# EAGLE design Medium_switch (EAGLE 9.6.2)
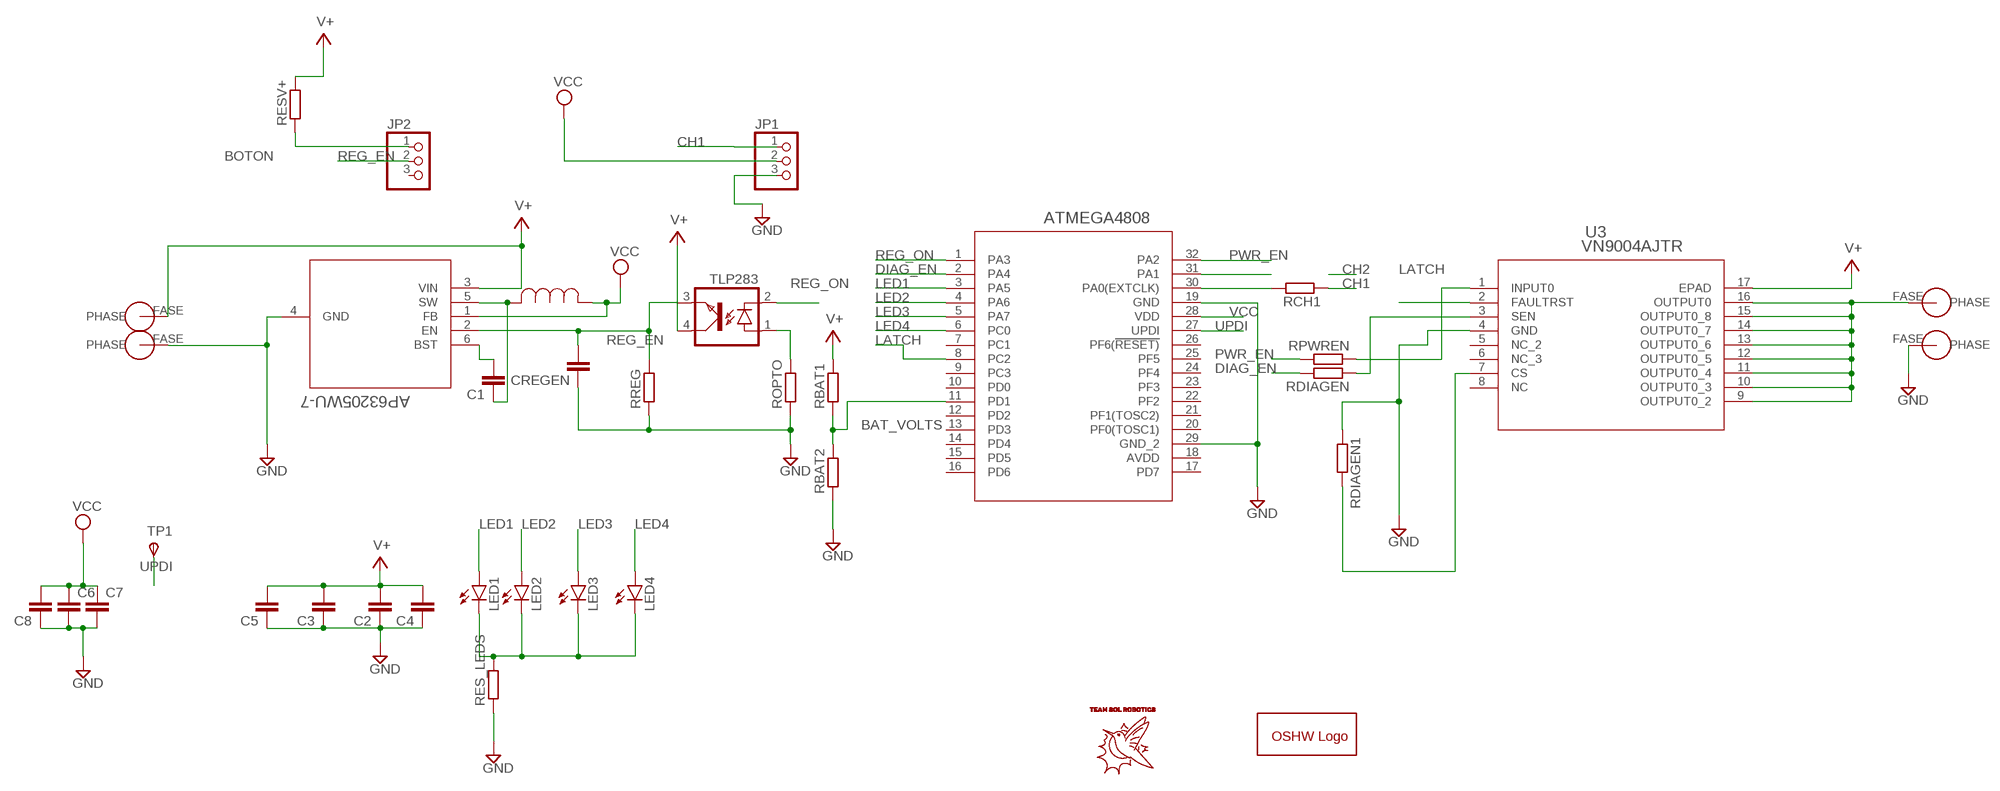
[diagram p0: schematic, sheet 1]

## Parts
BAT+  PHASE  [POWEROUT]
C1  C-EUC0402  [C0402]
C2  C-EUC1206  [C1206]
C3  C-EUC0402  [C0402]
C4  C-EUC1206  [C1206]
C5  C-EUC0603  [C0603]
C6  C-EUC0805  [C0805]
C7  C-EUC0805  [C0805]
C8  C-EUC0402  [C0402]
CREGEN  C-EUC0402  [C0402]
FASEA1  PHASE  [POWEROUT]
FASEA3  PHASE  [POWEROUT]
GOLD_ORB_SM1  OSHWLOGOLOGO5MM  [OSHW_5MM]
JP1  PINHD-1X03_2.54-S  [1X03-S]
JP2  PINHD-1X03_2.54-S  [1X03-S]
LED1  LEDSML0603  [SML0603]
LED2  LEDSML0603  [SML0603]
LED3  LEDSML0603  [SML0603]
LED4  LEDSML0603  [SML0603]
OK1  TLP283  [MINI-FLAT-4]
OUTPUTPWR  PHASE  [POWEROUT]
RBAT1  R-EU_R0603  [R0603]
RBAT2  R-EU_R0603  [R0603]
RCH1  R-EU_R0603  [R0603]
RDIAGEN  R-EU_R0603  [R0603]
RDIAGEN1  R-EU_R0603  [R0603]
RES_LEDS  R-EU_R0603  [R0603]
RESV+  R-EU_R0603  [R0603]
ROPTO  R-EU_R0603  [R0603]
RPWREN  R-EU_R0603  [R0603]
RREG  R-EU_R0603  [R0603]
TP1  TPSTP10SQ  [TP10SQ]
U2  AP63205WU-7  [SOIC_05WU-7_DIO]
U3  VN9004AJTR  [POWERSSO16_VN9004_STM]
U$1  ATMEGA4808  [QFP80P900X900X120-32N]
U$3  INDUCTOR4.7  [IND_NRS5030T100MMGJ_TAY]

## Nets
BAT_VOLTS: RBAT1.1 RBAT2.2 U$1.11(PD1)
BOTON: JP2.1 RESV+.1
CH1: JP1.1 RCH1.1
DIAG_EN: RDIAGEN.2 U$1.2(PA4)
GND: C2.1 C3.1 C4.1 C5.1 C6.2 C7.2 C8.1 CREGEN.1 FASEA1.FASE(PHASE) FASEA3.FASE(PHASE) JP1.3 RBAT2.1 RDIAGEN1.1 RES_LEDS.1 ROPTO.1 RREG.1 U2.4(GND) U3.4(GND) U$1.19(GND) U$1.29(GND_2)
LATCH: U3.2(FAULTRST) U$1.8(PC2)
LED1: LED1.A U$1.3(PA5)
LED2: LED2.A U$1.4(PA6)
LED3: LED3.A U$1.5(PA7)
LED4: LED4.A U$1.6(PC0)
N$1: OK1.1(A) ROPTO.2
N$2: LED1.C LED2.C LED3.C LED4.C RES_LEDS.2
N$3: RCH1.2 U$1.30(PA0(EXTCLK))
N$4: U$1.31(PA1)
N$5: RDIAGEN1.2 U3.7(CS)
N$6: C1.1 U2.5(SW) U$3.2
N$7: RPWREN.1 U3.1(INPUT0)
N$8: C1.2 U2.6(BST)
N$9: RDIAGEN.1 U3.3(SEN)
N$10: OUTPUTPWR.FASE(PHASE) U3.9(OUTPUT0_2) U3.10(OUTPUT0_3) U3.11(OUTPUT0_4) U3.12(OUTPUT0_5) U3.13(OUTPUT0_6) U3.14(OUTPUT0_7) U3.15(OUTPUT0_8) U3.16(OUTPUT0)
PWR_EN: RPWREN.2 U$1.32(PA2)
REG_EN: CREGEN.2 JP2.2 OK1.3(EMIT) RREG.2 U2.2(EN)
REG_ON: OK1.2(C) U$1.1(PA3)
UPDI: TP1.TP(PP) U$1.27(UPDI)
V+: BAT+.FASE(PHASE) C2.2 C3.2 C4.2 C5.2 OK1.4(COL) RBAT1.2 RESV+.2 U2.3(VIN) U3.17(EPAD)
VCC: C6.1 C7.1 C8.2 JP1.2 U2.1(FB) U$1.28(VDD) U$3.1
Unconnected: JP2.3 U3.5(NC_2) U3.6(NC_3) U3.8(NC) U$1.7(PC1) U$1.9(PC3) U$1.10(PD0) U$1.12(PD2) U$1.13(PD3) U$1.14(PD4) U$1.15(PD5) U$1.16(PD6) U$1.17(PD7) U$1.20(PF0(TOSC1)) U$1.21(PF1(TOSC2)) U$1.22(PF2) U$1.23(PF3) U$1.24(PF4) U$1.25(PF5) U$1.26(PF6(!RESET))

## Power pins joined to a net without a drawn wire
AVDD: U$1.18(AVDD)

## Library data of the parts
BAT+ FASEA1 FASEA3 OUTPUTPWR = PHASE:PHASE
C1-C8 CREGEN = rcl:C-EU: CAPACITOR, European symbol; SPICEPREFIX: C
GOLD_ORB_SM1 = oshw:OSHWLOGO: The OSHW logo for PCB layout
JP1 JP2 = pinhead-2:PINHD-1X03: PIN HEADER
LED1-LED4 = led:LED: LED OSRAM: - CHIPLED LG R971, LG N971, LY N971, LG Q971, LY Q971, LO R971, LY R971 LH N974, LH R974 LS Q976, LO Q976, LY Q976 LO Q996 - Hyper CHIPLED LW Q18S LB Q993, LB Q99A, LB R99A - SideLED LS A670, LO A670, LY A670, LG A670, LP A670 LB A673, LV A673, LT A673, LW A673 LH A674 LY A675 LS A676, LA A676, LO A676, LY A676, LW A676 LS A679, LY A679, LG A679 - Hyper Micro SIDELED® LS Y876, LA Y876, LO Y876, LY Y876 LT Y87S - SmartLED LW L88C, LW L88S LB L89C, LB L89S, LG L890 LS L89K, LO L89K, LY L89K LS L896, LA L896, LO L896, LY L896 - TOPLED LS T670, LO T670, LY T670, LG T670, LP T670 LSG T670, LSP T670, LSY T670, LOP T670, LYG T670 LG T671, LOG T671, LSG T671 LB T673, LV T673, LT T673, LW T673 LH T674 LS T676, LA T676, LO T676, LY T676, LB T676, LH T676, LSB T676, LW T676 LB T67C, LV T67C, LT T67C, LS T67K, LO T67K, LY T67K, LW E67C LS E67B, LA E67B, LO E67B, LY E67B, LB E67C, LV E67C, LT E67C LW T67C LS T679, LY T679, LG T679 LS T770, LO T770, LY T770, LG T770, LP T770 LB T773, LV T773, LT T773, LW T773 LH T774 LS E675, LA E675, LY E675, LS T675 LS T776, LA T776, LO T776, LY T776, LB T776 LHGB T686 LT T68C, LB T68C - Hyper Mini TOPLED® LB M676 - Mini TOPLED Santana® LG M470 LS M47K, LO M47K, LY M47K Source: http://www.osram.convergy.de LUXEON: - LUMILED® LXK2-PW12-R00, LXK2-PW12-S00, LXK2-PW14-U00, LXK2-PW14-V00 LXK2-PM12-R00, LXK2-PM12-S00, LXK2-PM14-U00 LXK2-PE12-Q00, LXK2-PE12-R00, LXK2-PE12-S00, LXK2-PE14-T00, LXK2-PE14-U00 LXK2-PB12-K00, LXK2-PB12-L00, LXK2-PB12-M00, LXK2-PB14-N00, LXK2-PB14-P00, LXK2-PB14-Q00 LXK2-PR12-L00, LXK2-PR12-M00, LXK2-PR14-Q00, LXK2-PR14-R00 LXK2-PD12-Q00, LXK2-PD12-R00, LXK2-PD12-S00 LXK2-PH12-R00, LXK2-PH12-S00 LXK2-PL12-P00, LXK2-PL12-Q00, LXK2-PL12-R00 Source: www.luxeon.com KINGBRIGHT: KA-3528ASYC Source: www.kingbright.com
OK1 = optocoupler:TLP283: TOSHIBA PHOTOCOUPLER GaAs IRED & PHOTO-TRANSISTOR Source: http://www.semicon.toshiba.co.jp/td/en/Opto/Photocoupler/en_20050928_TLP283_datasheet.pdf; OC_FARNELL: unknown; OC_NEWARK: unknown
RBAT1 RBAT2 RCH1 RDIAGEN RDIAGEN1 RES_LEDS RESV+ ROPTO RPWREN RREG = rcl:R-EU_: RESISTOR, European symbol; SPICEPREFIX: R
TP1 = testpad:TPS: TEST PIN
U2 = AP63205WU-7:AP63205WU-7; BUILT_BY: EMA_Matt; COPYRIGHT: Copyright (C) 2018 Accelerated Designs. All rights reserved; MANUFACTURER_PART_NUMBER: AP63205WU-7; SOURCELIBRARY: Diodes_Inc_2019-12-05; VENDOR: Diodes Inc
U3 = highside:VN9004AJTR; COPYRIGHT: Copyright (C) 2023 Ultra Librarian. All rights reserved.; DIGI-KEY_PART_NUMBER_1: 497-VN9004AJTR-ND; DIGI-KEY_PART_NUMBER_2: 497-VN9004AJTRCT-ND; DIGI-KEY_PART_NUMBER_3: 497-VN9004AJTRDKR-ND; MANUFACTURER_PART_NUMBER: VN9004AJTR; MFR_NAME: STMicroelectronics
U$1 = Atmega4808:ATMEGA4808
U$3 = Inductor4.7:INDUCTOR4.7

## Board
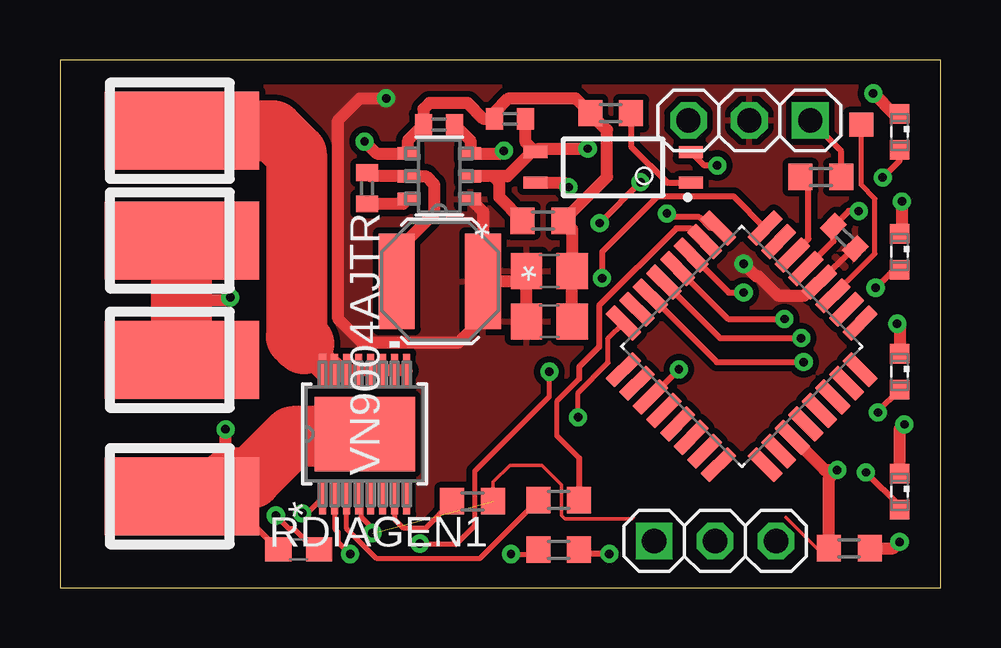
[diagram p1: board, top side]
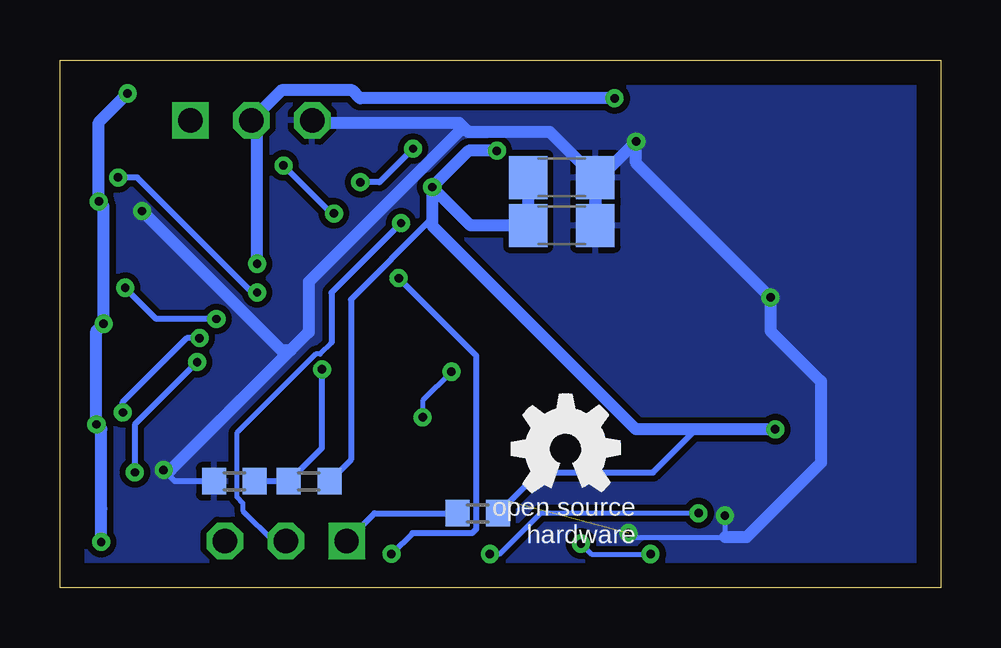
[diagram p2: board, bottom side, seen from below]

Size 36.72 x 22 mm. Coordinates in mm from the lower left corner, seen from the top.
Outline: 0,0 36.72,0 36.72,22 0,22 0,0
Copper layers (1*16): Top 0.035mm / dielectric 1.5mm / Bottom 0.035mm
Design rules "default": minimum track width 6mil, minimum drill 0.35mm, track to track 6mil, track to pad 6mil, pad to pad 6mil, via to via 6mil, smd to smd 6mil, copper to edge 40mil, drill to drill 6mil, minimum pad ring 10mil, minimum via ring 8mil, stop-mask expansion 4mil, vias tented up to drill 0mil, thermal gap 10mil

### Footprints (pad centres in the part's own frame; a part is rotated, then mirrored left to right if it is on the bottom)
POWEROUT = smd 3.251 x 6.452: FASE 0,0
C0402 = smd 0.7 x 0.9: 1 -0.65,0; 2 0.65,0
C1206 = smd 1.6 x 1.8: 1 -1.4,0; 2 1.4,0
C0603 = smd 1.1 x 1: 1 -0.85,0; 2 0.85,0
C0805 = smd 1.3 x 1.5: 1 -0.95,0; 2 0.95,0
1X03-S = drill 1.016 square: 1 -2.54,0 | drill 1.016 octagon: 2 0,0; 3 2.54,0
SML0603 = smd 0.8 x 0.8: A 0.75,0; C -0.75,0
MINI-FLAT-4 = smd 1 x 0.5: 1 -3.24,0.635; 2 -3.24,-0.635; 3 3.24,-0.635; 4 3.24,0.635
R0603 = smd 1 x 1.1: 1 -0.85,0; 2 0.85,0
TP10SQ = smd 1 x 1: TP 0,0
SOIC_05WU-7_DIO = smd 0.896 x 0.517: 1 -1.299,0.95; 2 -1.299,0; 3 -1.299,-0.95; 4 1.299,-0.95; 5 1.299,0; 6 1.299,0.95
POWERSSO16_VN9004_STM = smd 1.391 x 0.305: 1 -2.651,1.75; 2 -2.651,1.25; 3 -2.651,0.75; 4 -2.651,0.25; 5 -2.651,-0.25; 6 -2.651,-0.75; 7 -2.651,-1.25; 8 -2.651,-1.75; 9 2.651,-1.75; 10 2.651,-1.25; 11 2.651,-0.75; 12 2.651,-0.25; 13 2.651,0.25; 14 2.651,0.75; 15 2.651,1.25; 16 2.651,1.75 | smd 3.099 x 4.191: 17 0,0
QFP80P900X900X120-32N = smd 1.6 x 0.55: 1 -4.18,2.8; 2 -4.18,2; 3 -4.18,1.2; 4 -4.18,0.4; 5 -4.18,-0.4; 6 -4.18,-1.2; 7 -4.18,-2; 8 -4.18,-2.8; 17 4.18,-2.8; 18 4.18,-2; 19 4.18,-1.2; 20 4.18,-0.4; 21 4.18,0.4; 22 4.18,1.2; 23 4.18,2; 24 4.18,2.8 | smd 0.55 x 1.6: 9 -2.8,-4.18; 10 -2,-4.18; 11 -1.2,-4.18; 12 -0.4,-4.18; 13 0.4,-4.18; 14 1.2,-4.18; 15 2,-4.18; 16 2.8,-4.18; 25 2.8,4.18; 26 2,4.18; 27 1.2,4.18; 28 0.4,4.18; 29 -0.4,4.18; 30 -1.2,4.18; 31 -2,4.18; 32 -2.8,4.18
IND_NRS5030T100MMGJ_TAY = smd 1.499 x 3.988: 1 -1.8,0; 2 1.8,0

### Placement (x,y rotation side)
BAT+  5.08,3.81 270 top
C1  12.8,16.65 270 top
C2  15.8,15.1 180 bottom
C3  15.8,19.3 0 top
C4  15.8,17.1 180 bottom
C5  9.95,1.6 180 top
C6  20.4,13.2 0 top
C7  20.4,11.1 0 top
C8  32.7,14.6 315 top
CREGEN  18.76,19.54 0 top
FASEA1  5.08,9.49 270 top
FASEA3  5.08,14.47 270 top
GOLD_ORB_SM1  15.64,5.78 0 bottom
JP1  28.74,19.48 180 top
JP2  27.31,1.94 0 top
LED1  35,19 270 top
LED2  35,14 270 top
LED3  35,9 270 top
LED4  35,4 270 top
OK1  23.06,17.52 180 top
OUTPUTPWR  5.08,19.05 270 top
RBAT1  26.34,4.43 0 bottom
RBAT2  29.45,4.43 0 bottom
RCH1  31.72,17.12 180 top
RDIAGEN  20.79,3.65 0 top
RDIAGEN1  17.2,3.6 180 top
RES_LEDS  32.9,1.64 0 top
RESV+  19.3,3.1 0 bottom
ROPTO  22.96,19.78 0 top
RPWREN  20.79,1.58 0 top
RREG  20.14,15.3 180 top
TP1  33.4,19.3 180 top
U2  15.81,17.15 180 top
U3  12.7,6.4 90 top
U$1  28.42,10.06 315 top
U$3  15.84,12.77 180 top

### Tracks (layer width: path | path; a pad name or v marks a point on that pad's centre or on a via)
BAT_VOLTS  (via drill 0.35)
  Top 0.254: v25.8,9.1 24.65,7.95 U$1.11
  Bottom 0.254: RBAT2.2 RBAT1.1 25.8,5.82 v25.8,9.1
BOTON
  Bottom 0.254: JP2.1 23.61,3.1 RESV+.1
CH1
  Top 0.254: RCH1.1 32.57,18.19 JP1.1
DIAG_EN
  Top 0.2: 21.64,8.7 20.7,7.76 20.7,6.34 21.64,5.4
  Top 0.254: 21.64,8.7 21.64,9.19 22.47,10.03 22.47,11.75 25.7,14.97 26.29,14.97 26.83,14.43 U$1.2 | 21.64,5.4 RDIAGEN.2
GND  (via drill 0.35)  (1 unrouted)
  Top 0.152: RES_LEDS.1 31.55,1.64 30.26,2.93 | 23.91,2.93 23.85,2.87 21.05,2.87 20.91,3 20.91,4.29 20.1,5.1 18.75,5.1 18.05,4.4 RDIAGEN1.1
  Top 0.2: v9,3 9.55,2.45 9.76,2.45 10.61,1.6 C5.1 | U3.4 12.54,3.65 12.54,2.95 13.02,2.47 v13.02,2.27
  Top 0.254: U$1.29 32.24,14.45 C8.1 32.88,15.7 v33.3,15.7
  Top 0.508: 5.08,12 7,12 v7.1,12.1 | v12.7,18.6 13.2,18.1 U2.4 14.51,18.66 C3.1 15.15,19.95 15.4,20.2 17,20.2 17.66,19.54 CREGEN.1 18.11,19.81 18.7,20.4 21.49,20.4 ROPTO.1 22.81,19.08 22.81,17.12 RREG.1 21.35,14.94 C6.2 C7.2 | U$1.19 31.88,4.9 v32.4,4.9 | 32.25,4.75 v32.4,4.9 | RES_LEDS.1 32.05,4.55 v32.4,4.9
  Top 2.54: FASEA1.FASE 5.08,12 FASEA3.FASE
  Bottom 0.2: v9,3 9,2.1 12.85,2.1 v13.02,2.27
  Bottom 0.254: RBAT2.1 31.93,4.43 v32.4,4.9
  Bottom 0.508: 9,2.1 8.1,2.1 5,5.2 5,8.6 7.1,10.7 v7.1,12.1 12.7,17.7 v12.7,18.6 14.4,16.9 C2.1 C4.1 16.3,19 19.7,19 19.9,19.2 | 19.9,19.2 26.35,12.75 26.35,10.65 27.1,9.9 | JP1.3 26.1,19.38 20.08,19.38 19.9,19.2 | v32.4,4.9 32.1,4.9 27.1,9.9 | v33.3,15.7 27.5,9.9 27.1,9.9
  pour Bottom (isolate 0.254): -0.1,0 -0.1,22 36.8,22 36.8,0
LATCH  (via drill 0.35)
  Top 0.2: v20.4,9 20.4,7.96 17.3,4.86 17.3,2.6 16.5,1.8 15.03,1.8 v15,1.83 | U$1.8 22.85,10.4 22.85,9.38 21.6,8.12 v21.6,7.1 | v12.1,1.39 11.6,1.89 11.6,2.31 11.45,2.46 U3.2
  Bottom 0.2: v20.4,9 21.6,7.8 v21.6,7.1 | v15,1.83 14.56,1.39 v12.1,1.39
LED1  (via drill 0.35)
  Top 0.254: U$1.3 27.88,12.3 v28.5,12.3 | v34.3,17.1 35,17.8 LED1.A
  Bottom 0.254: v28.5,12.3 28.7,12.3 33.5,17.1 v34.3,17.1
LED2  (via drill 0.35)
  Top 0.254: U$1.4 27.85,11.2 v30.2,11.2 | v34,12.5 34.75,13.25 LED2.A
  Bottom 0.254: v30.2,11.2 32.7,11.2 v34,12.5
LED3  (via drill 0.35)
  Top 0.254: U$1.5 27.51,10.4 v30.9,10.4 | v34.1,7.3 34.1,7.35 LED3.A
  Bottom 0.254: v34.1,7.3 34.1,7.73 31.43,10.4 v30.9,10.4
LED4  (via drill 0.35)
  Top 0.254: U$1.6 27.38,9.4 v31,9.4 | v33.6,4.8 35,3.4 LED4.A
  Bottom 0.254: v31,9.4 33.6,6.8 v33.6,4.8
N$1
  Top 0.254: ROPTO.2 23.81,18.39 25.32,16.89 OK1.1
N$2  (via drill 0.35)
  Top 0.508: LED4.C 35,6.6 v35.2,6.8 | v34.9,11 35,10.9 LED3.C | v35.1,16.1 35.1,14.85 LED2.C | v33.9,20.61 34.76,19.75 LED1.C | RES_LEDS.2 34.74,1.64 v35,1.9
  Bottom 0.508: v33.9,20.61 35.1,19.41 v35.1,16.1 34.9,15.9 v34.9,11 35.2,10.7 v35.2,6.8 35,6.6 35,3.3 v35,1.9
N$3
  Top 0.254: U$1.30 31.2,14.54 31.2,16.79 RCH1.2
N$5
  Top 0.2: 16.2,3.75 RDIAGEN1.2 15.25,2.5 14.3,2.5 13.95,2.85 U3.7
N$6
  Top 0.508: C1.1 12.95,17.15 U2.5 15.25,17.15 15.6,16.8 15.6,15.6 14.04,14.04 U$3.2
N$7  (via drill 0.35)
  Top 0.2: U3.1 10.3,3.1 v10.1,3.1 | v18.8,1.39 19.75,1.39 RPWREN.1
  Bottom 0.2: v18.8,1.39 18.4,1.39 16.69,3.1 v10.1,3.1
N$8
  Top 0.508: U2.6 14.31,16 C1.2
N$9
  Top 0.2: RDIAGEN.1 18.79,2.5 17.49,1.2 13.2,1.2 11.95,2.45 U3.3
N$10
  Top 0.508: U3.9 U3.10 U3.11 U3.12 U3.13 U3.14 U3.15 11.3,9.05 U3.16 10.16,9.84 10.16,10.16
  Top 1.27: 10.16,10.16 10.16,11.43 | 9.86,10.46 11.27,9.05 11.3,9.05
  Top 2.54: OUTPUTPWR.FASE 8.89,19.05 9.86,18.08 9.86,10.46 10.16,10.16
PWR_EN  (via drill 0.35)
  Top 0.254: U$1.32 28.09,16.31 24.91,16.31 22.6,14 v22.6,12.9 | v22.9,1.4 21.82,1.4 RPWREN.2
  Bottom 0.254: v22.6,12.9 19.37,9.67 19.37,2.43 19.53,2.27 22.03,2.27 v22.9,1.4
REG_EN  (via drill 0.35)
  Top 0.254: v22.5,15.2 v24.2,16.9
  Top 0.508: 18.05,17.15 18.65,17.15 19.66,18.16 OK1.3 | 18.05,17.15 U2.2 | 18.05,17.15 18.32,16.89 18.32,16.27 RREG.2 | OK1.3 19.41,18.57 CREGEN.2 | OK1.3 19.96,18.3 v22,18.3
  Bottom 0.203: 25.4,10.2 25.87,9.73 26.06,9.73 29.35,6.44 29.35,3.77 29.1,3.52 29.1,3.2 27.84,1.94 JP2.2
  Bottom 0.254: v22,18.3 23.4,16.9 v24.2,16.9 | 25.4,10.2 25.4,12.3 v22.5,15.2
REG_ON  (via drill 0.35)
  Top 0.254: U$1.1 27.1,15 26.65,15.44 25.46,15.44 v25.3,15.6 | v27.4,17.6 26.86,17.6 OK1.2
  Bottom 0.254: v27.4,17.6 25.4,15.6 v25.3,15.6
UPDI
  Top 0.2: TP1.TP 33.4,16.79 33.98,16.21 33.98,13.92 U$1.27
V+  (via drill 0.35)
  Top 0.254: C5.2 7.2,3.5 5.39,3.5 BAT+.FASE
  Top 0.508: BAT+.FASE 6.9,5.63 v6.9,6.6 | C3.2 17.11,18.64 U2.3 18.39,18.1 v18.51,18.21 | OK1.4 21.02,16.89 v21.2,16.7
  Top 2.54: BAT+.FASE 6.35,3.81 7.11,4.57 7.97,4.57 9.7,6.3 12.6,6.3 U3.17
  Bottom 0.254: 8.5,6.6 10.2,6.6 12,4.8 16.75,4.8 RESV+.2 | v21.2,16.7 21.2,15.4 24.59,12.01 24.59,5.33 RBAT1.2
  Bottom 0.508: v6.9,6.6 8.5,6.6 12.7,6.6 21.2,15.1 v21.2,16.7 | v21.2,16.7 19.6,15.1 C2.2 C4.2 | v18.51,18.21 19.68,18.21 v21.2,16.7
VCC  (via drill 0.35)
  Top 0.254: U$1.28 33.07,14.14 C8.2
  Top 0.508: U2.1 17.64,15.67 U$3.1 | C7.1 C6.1 19.02,12.77 U$3.1 | U$3.1 17.64,11.24 16.6,10.2 12.6,10.2 11.6,11.2 11.6,19.5 12.5,20.4 v13.6,20.4 | U$1.28 31.59,12.73 31.02,12.16 29.95,12.16 29.12,12.98 29.02,12.98 v28.5,13.5
  Bottom 0.508: v13.6,20.4 24.2,20.4 24.53,20.73 27.49,20.73 JP1.2 28.5,19.24 v28.5,13.5
  pour Top (isolate 0.254): 0,0 0,22 36.7,22 36.7,0

### Text on the board
bValues: Diseñado en México | Por xDzohlx